# EAGLE design modulo_interruptor (EAGLE 7.6.0)
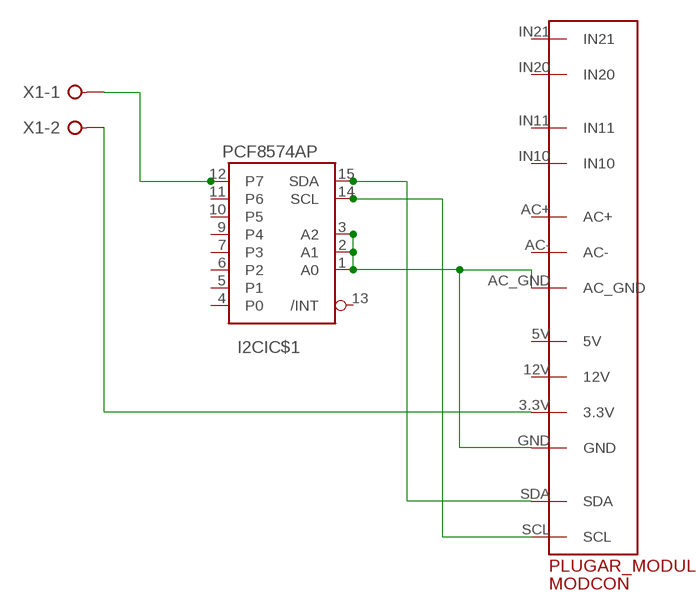
[diagram p0: schematic, sheet 1]

## Parts
I2C  PCF8574AP  [DIL16]
MODCON  PLUGARPADS  [PLUGAR]
X1  W237-02P  [W237-132]

## Nets
GND: I2C.1(IC$1:A0) I2C.2(IC$1:A1) I2C.3(IC$1:A2) MODCON.AC_GND MODCON.GND
N$1: MODCON.3.3V X1.2
N$2: I2C.12(IC$1:P7) X1.1
N$3: I2C.14(IC$1:SCL) MODCON.SCL
N$4: I2C.15(IC$1:SDA) MODCON.SDA
Unconnected: I2C.4(IC$1:P0) I2C.5(IC$1:P1) I2C.6(IC$1:P2) I2C.7(IC$1:P3) I2C.9(IC$1:P4) I2C.10(IC$1:P5) I2C.11(IC$1:P6) I2C.13(IC$1:/INT) MODCON.5V MODCON.12V MODCON.AC+ MODCON.AC- MODCON.IN10 MODCON.IN11 MODCON.IN20 MODCON.IN21

## Power pins joined to a net without a drawn wire
GND: I2C.8(PWR:GND)
VCC: I2C.16(PWR:VCC)

## Library data of the parts
I2C = i2c:PCF8574: Remote 8-Bit I/O Expander for I²C Bus
MODCON = PLUGAR_pads:PLUGARPADS
X1 = con-wago-508:W237-02P: WAGO SREW CLAMP; OC_FARNELL: unknown; OC_NEWARK: unknown

## Board
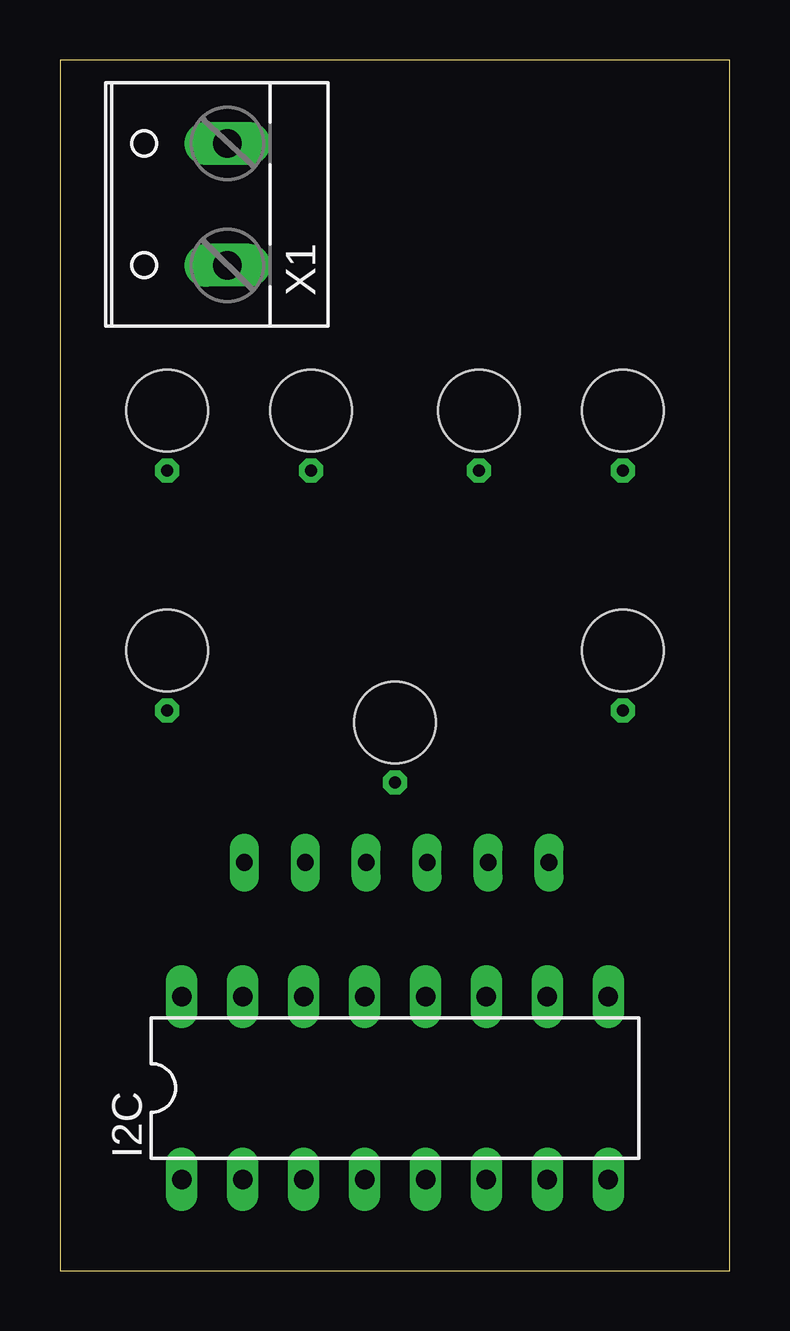
[diagram p1: board, top side]
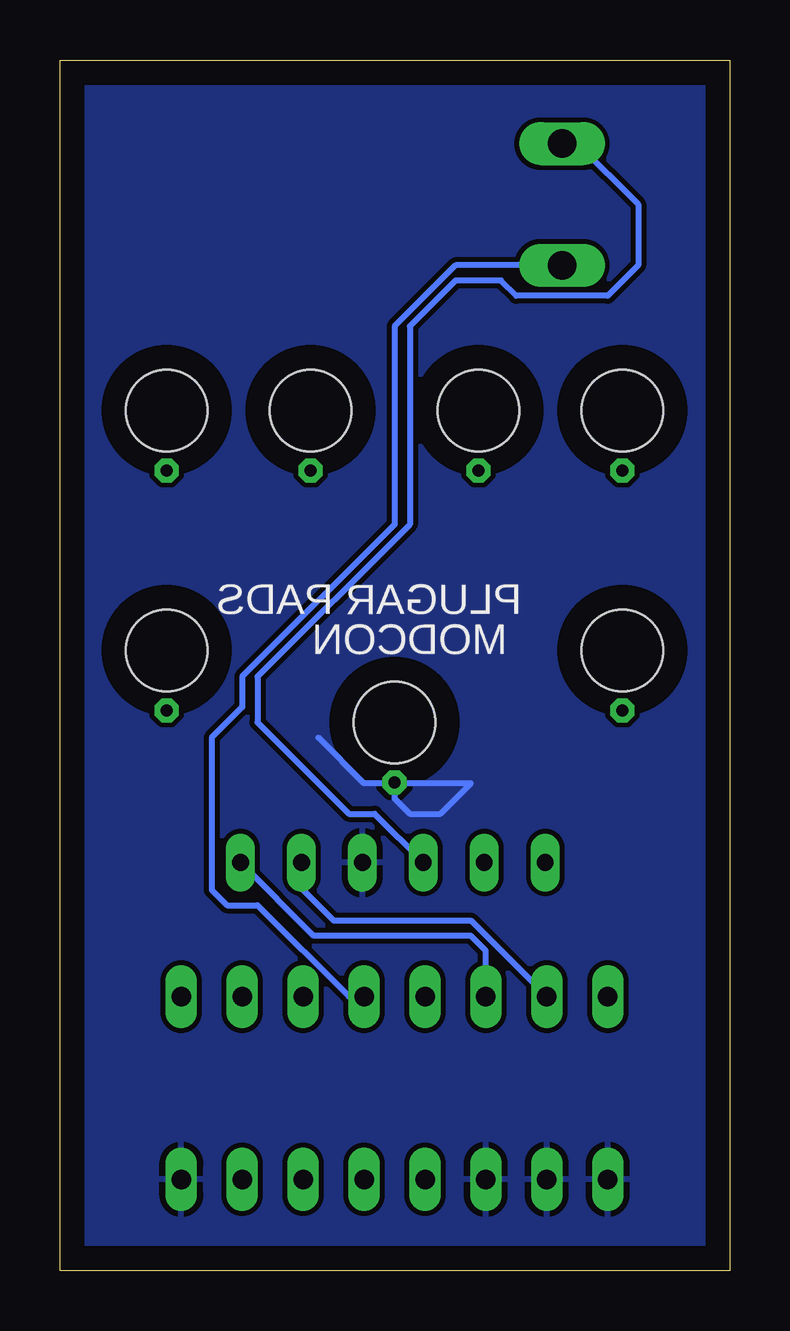
[diagram p2: board, bottom side, seen from below]

Size 27.92 x 50.47 mm. Coordinates in mm from the lower left corner, seen from the top.
Outline: 0,0 27.92,0 27.92,50.47 0,50.47 0,0
Copper layers (1*16): Top 0.035mm / dielectric 1.5mm / Bottom 0.035mm
Design rules "default": minimum track width 10mil, minimum drill 24mil, track to track 8mil, track to pad 8mil, pad to pad 8mil, via to via 8mil, smd to smd 8mil, copper to edge 40mil, drill to drill 8mil, minimum pad ring 10mil, minimum via ring 8mil, stop-mask expansion 4mil, vias tented up to drill 0mil, thermal gap 10mil

### Footprints (pad centres in the part's own frame; a part is rotated, then mirrored left to right if it is on the bottom)
DIL16 = drill 0.813 long: 1 -8.89,-3.81; 2 -6.35,-3.81; 3 -3.81,-3.81; 4 -1.27,-3.81; 5 1.27,-3.81; 6 3.81,-3.81; 7 6.35,-3.81; 8 8.89,-3.81; 9 8.89,3.81; 10 6.35,3.81; 11 3.81,3.81; 12 1.27,3.81; 13 -1.27,3.81; 14 -3.81,3.81; 15 -6.35,3.81; 16 -8.89,3.81
PLUGAR = drill 0.7 long: 3.3V -1.2,-5.84; 5V -3.74,-5.84; 12V -6.28,-5.84; GND 1.34,-5.84; SCL 6.42,-5.84; SDA 3.88,-5.84 | drill 0.5 pad 0.61 octagon: AC+ 9.5,0.5; AC- -9.5,0.5; AC_GND 0,-2.5; IN10 -9.5,10.5; IN11 -3.5,10.5; IN20 9.5,10.5; IN21 3.5,10.5 | hole 3.4: 0,0; 9.5,3; -9.5,3; -9.5,13; 9.5,13; -3.5,13; 3.5,13
W237-132 = drill 1.194 long: 1 -2.54,-0.635; 2 2.54,-0.635

### Placement (x,y rotation side)
I2C  13.97,7.62 0 top
MODCON  13.97,22.86 0 top
X1  6.35,44.45 90 top

### Tracks (layer width: path | path; a pad name or v marks a point on that pad's centre or on a via)
GND
  Bottom 0.254: MODCON.AC_GND 13.97,20.32 | 13.97,20.32 13.97,19.68 13.34,19.05 12.06,19.05 10.79,20.32 13.97,20.32 | 13.97,20.32 15.24,20.32 17.14,22.23
  pour Bottom: 0,50.8 0,0 27.94,0 27.94,50.8
N$1
  Bottom 0.254: 12.7,17.14 MODCON.3.3V | X1.2 6.35,46.99 3.81,44.45 3.81,41.91 5.08,40.64 8.89,40.64 9.53,41.27 11.43,41.27 13.34,39.37 13.34,31.11 19.68,24.77 19.68,22.86 15.88,19.05 14.8,19.05 MODCON.3.3V | 12.7,16.51 12.7,16.95 MODCON.3.3V
N$2
  Bottom 0.254: X1.1 11.43,41.91 13.97,39.37 13.97,31.11 20.32,24.77 20.32,23.5 21.59,22.23 21.59,15.88 20.95,15.24 19.68,15.24 15.88,11.43 I2C.12
N$3
  Bottom 0.254: 20.32,17.14 MODCON.SCL 17.34,13.97 10.79,13.97 10.16,13.34 I2C.14
N$4
  Bottom 0.254: I2C.15 10.79,14.61 16.51,14.61 17.78,15.88 17.78,16.95 MODCON.SDA